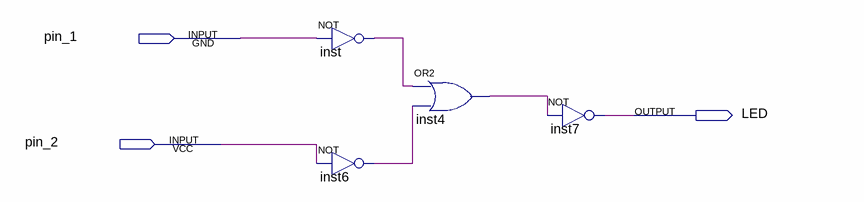
[diagram p0: schematic sheet]
// Quartus schematic MaxV_test.bdf as structural Verilog: 4 symbols, 3 pins
module MaxV_test (
  input  pin_1,
  input  pin_2,
  output LED
);

  wire inst4_out, inst6_out, inst_out;

  not inst (inst_out, pin_1);
  not inst6 (inst6_out, pin_2);
  or inst4 (inst4_out, inst_out, inst6_out);
  not inst7 (LED, inst4_out);
endmodule
